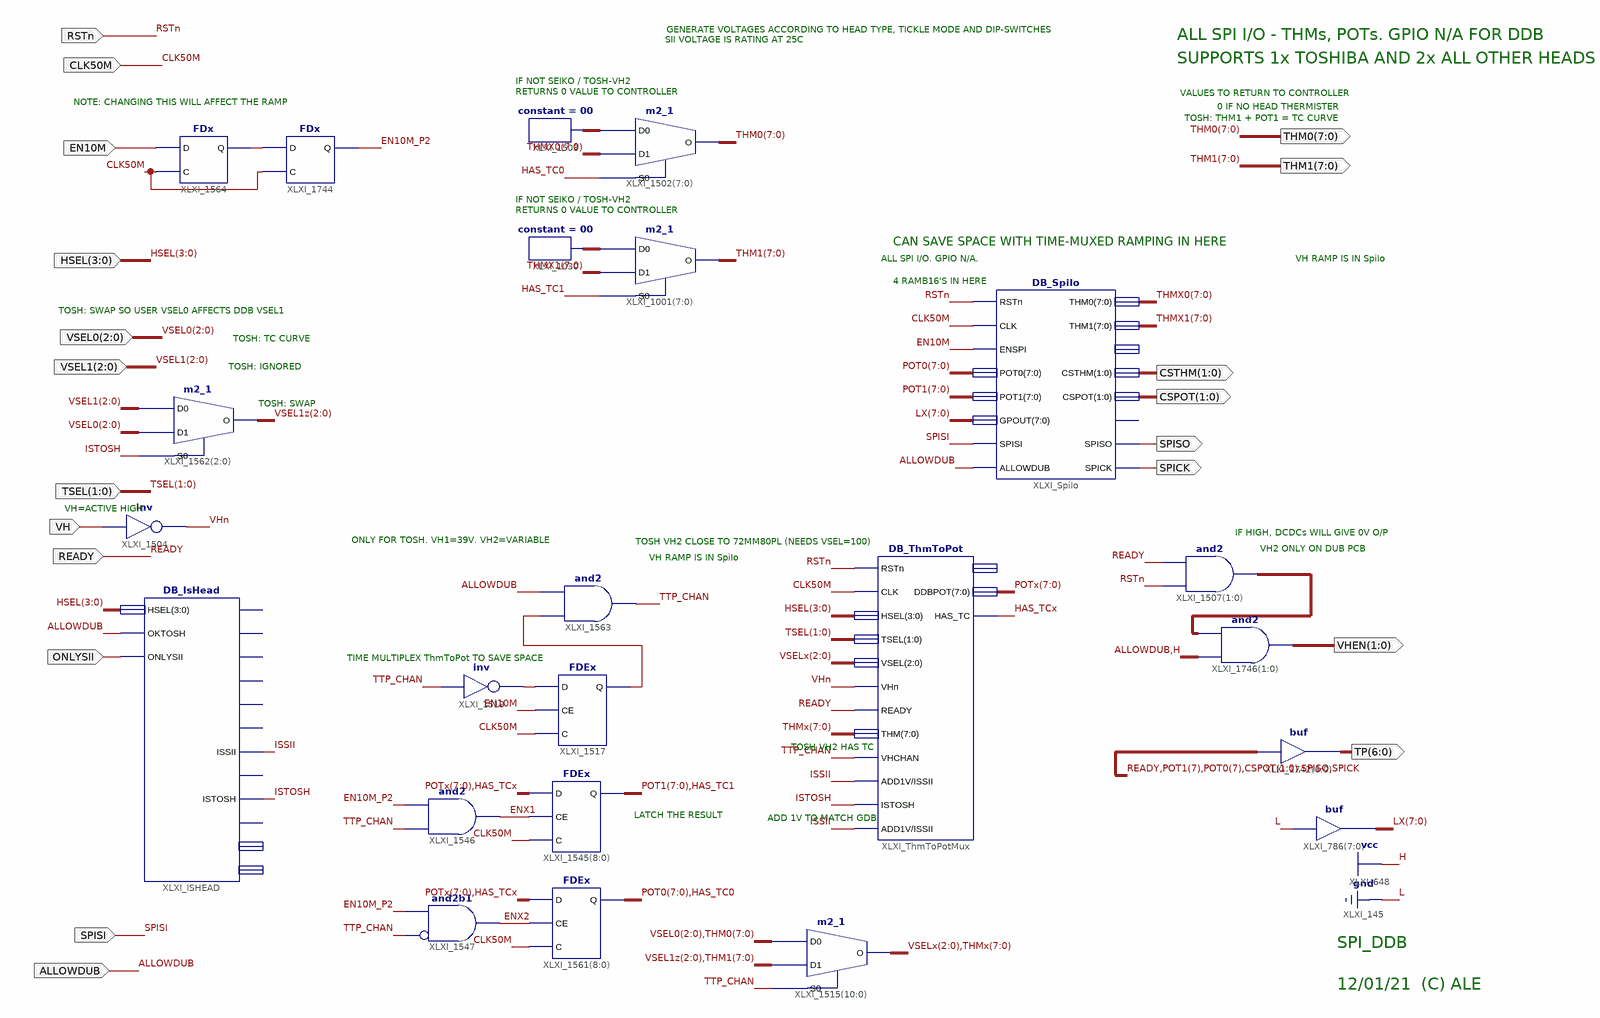
[diagram p0: schematic sheet 1]
// Xilinx ISE schematic DB_Spi_DDB.sch (spartan3e) as structural Verilog: 23 symbols, 20 ports
module DB_Spi_DDB (
  input  CLK50M,
  input  RSTn,
  input  SPISI,
  input  [3:0] HSEL,
  input  [1:0] TSEL,
  input  READY,
  input  [2:0] VSEL0,
  input  [2:0] VSEL1,
  input  EN10M,
  input  VH,
  input  ALLOWDUB,
  input  ONLYSII,
  output [7:0] THM1,
  output [7:0] THM0,
  output [1:0] CSTHM,
  output [1:0] CSPOT,
  output SPISO,
  output SPICK,
  output [6:0] TP,
  output [1:0] VHEN
);

  wire EN10M_P2, ENX1, ENX2, HAS_TC0, HAS_TC1, HAS_TCx, ISSII, ISTOSH, TTP_CHAN, VHn, XLXN_209, XLXN_211,
       XLXN_226;
  wire [1:0] XLXN_230;
  wire [2:0] VSEL1z, VSELx;
  wire [7:0] LX, POT0, POT1, POTx, THMx, THMX0, THMX1, XLXN_46, XLXN_180;

  not XLXI_1504 (VHn, VH);
  assign LX = {8{1'b0}};  // buf XLXI_786[7..0], 8 bits wide
  and XLXI_1547 (ENX2, ~TTP_CHAN, EN10M_P2);  // and2b1
  not XLXI_1519 (XLXN_209, TTP_CHAN);
  FDEx XLXI_1517 (.C(CLK50M), .CE(EN10M), .D(XLXN_209), .Q(XLXN_211));
  FDEx XLXI_1545[8:0] (.C(CLK50M), .CE(ENX1), .D({POTx, HAS_TCx}), .Q({POT1, HAS_TC1}));
  and XLXI_1546 (ENX1, TTP_CHAN, EN10M_P2);
  FDEx XLXI_1561[8:0] (.C(CLK50M), .CE(ENX2), .D({POTx, HAS_TCx}), .Q({POT0, HAS_TC0}));
  m2_1 XLXI_1515[10:0] (.D0({VSEL0, THM0}), .D1({VSEL1z, THM1}), .S0(TTP_CHAN), .O({VSELx, THMx}));
  DB_ThmToPot XLXI_ThmToPotMux (
    .ADD1V(ISSII), .CLK(CLK50M), .DDBPOT(POTx), .HAS_TC(HAS_TCx), .HSEL(HSEL), .ISSII(ISSII),
    .ISTOSH(ISTOSH), .READY(READY), .RSTn(RSTn), .THM(THMx), .TSEL(TSEL), .VHCHAN(TTP_CHAN), .VHn(VHn),
    .VSEL(VSELx));  // open: GDBPOT
  m2_1 XLXI_1562[2:0] (.D0(VSEL1), .D1(VSEL0), .S0(ISTOSH), .O(VSEL1z));
  and XLXI_1563 (TTP_CHAN, XLXN_211, ALLOWDUB);
  DB_SpiIo XLXI_SpiIo (
    .ALLOWDUB(ALLOWDUB), .CLK(CLK50M), .CSPOT(CSPOT), .CSTHM(CSTHM), .ENSPI(EN10M), .GPOUT(LX), .POT0(POT0),
    .POT1(POT1), .RSTn(RSTn), .SPICK(SPICK), .SPISI(SPISI), .SPISO(SPISO), .THM0(THMX0), .THM1(THMX1));  // open: CSGP, GPIN
  DB_IsHead XLXI_ISHEAD (
    .HSEL(HSEL), .ISSII(ISSII), .ISTOSH(ISTOSH), .OKTOSH(ALLOWDUB), .ONLYSII(ONLYSII));  // open: HIRES, IS144MM, IS18MM, IS34MM, IS35PL, IS54MM, IS72MM, ISSIZE, ISTYPE, ISX128
  FDx XLXI_1564 (.C(CLK50M), .D(EN10M), .Q(XLXN_226));
  assign TP = {READY, POT1[7], POT0[7], CSPOT, SPISO, SPICK};  // buf XLXI_1742[6..0], 7 bits wide
  FDx XLXI_1744 (.C(CLK50M), .D(XLXN_226), .Q(EN10M_P2));
  m2_1 XLXI_1502[7:0] (.D0(XLXN_180), .D1(THMX0), .S0(HAS_TC0), .O(THM0));
  constant #(.CValue("00")) XLXI_1503 (.O(XLXN_180));
  m2_1 XLXI_1001[7:0] (.D0(XLXN_46), .D1(THMX1), .S0(HAS_TC1), .O(THM1));
  constant #(.CValue("00")) XLXI_1030 (.O(XLXN_46));
  assign VHEN = {ALLOWDUB, 1'b1} & XLXN_230;  // and2 XLXI_1746[1..0], 2 bits wide
  assign XLXN_230 = {2{RSTn}} & {2{READY}};  // and2 XLXI_1507[1..0], 2 bits wide

  // Notes on the sheet:
  //   GENERATE VOLTAGES ACCORDING TO HEAD TYPE, TICKLE MODE AND DIP-SWITCHES
  //   ALL SPI I/O - THMs, POTs. GPIO N/A FOR DDB
  //   SII VOLTAGE IS RATING AT 25C
  //   SUPPORTS 1x TOSHIBA AND 2x ALL OTHER HEADS
  //   IF NOT SEIKO / TOSH-VH2
  //   RETURNS 0 VALUE TO CONTROLLER
  //   VALUES TO RETURN TO CONTROLLER
  //   NOTE: CHANGING THIS WILL AFFECT THE RAMP
  //   0 IF NO HEAD THERMISTER
  //   TOSH: THM1 + POT1 = TC CURVE
  //   IF NOT SEIKO / TOSH-VH2
  //   RETURNS 0 VALUE TO CONTROLLER
  //   CAN SAVE SPACE WITH TIME-MUXED RAMPING IN HERE
  //   ALL SPI I/O. GPIO N/A.
  //   VH RAMP IS IN SpiIo
  //   4 RAMB16'S IN HERE
  //   TOSH: SWAP SO USER VSEL0 AFFECTS DDB VSEL1
  //   TOSH: TC CURVE
  //   TOSH: IGNORED
  //   TOSH: SWAP
  //   VH=ACTIVE HIGH
  //   IF HIGH, DCDCs WILL GIVE 0V O/P
  //   ONLY FOR TOSH. VH1=39V. VH2=VARIABLE
  //   TOSH VH2 CLOSE TO 72MM80PL (NEEDS VSEL=100)
  //   VH2 ONLY ON DUB PCB
  //   VH RAMP IS IN SpiIo
  //   TIME MULTIPLEX ThmToPot TO SAVE SPACE
  //   TOSH VH2 HAS TC
  //   LATCH THE RESULT
  //   ADD 1V TO MATCH GDB
  //   SPI_DDB
  //   12/01/21  (C) ALE
endmodule
